# EAGLE schematic NyanTimer-v4 (EAGLE 9.2.2)
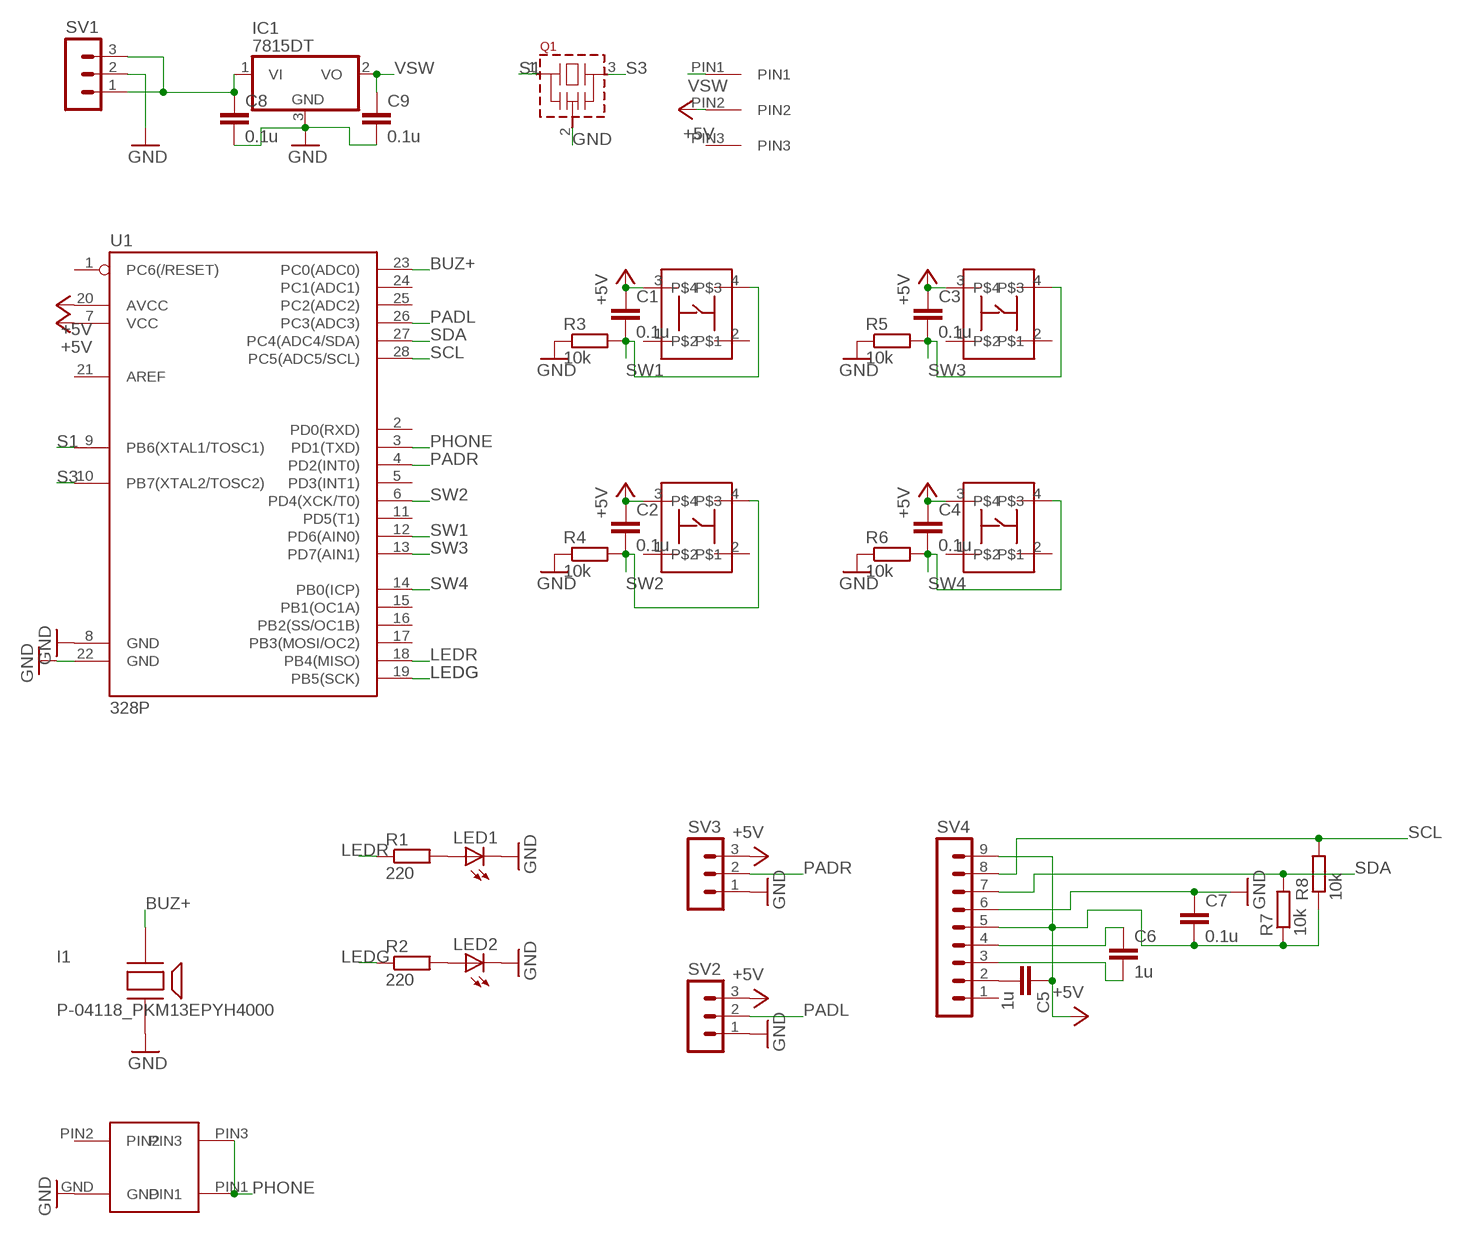
[diagram p0: schematic, sheet 1]

## Parts
C1  0.1u  C-EU025-024X044  [C025-024X044]
C2  0.1u  C-EU025-024X044  [C025-024X044]
C3  0.1u  C-EU025-024X044  [C025-024X044]
C4  0.1u  C-EU025-024X044  [C025-024X044]
C5  1u  C-EU025-024X044  [C025-024X044]
C6  1u  C-EU025-024X044  [C025-024X044]
C7  0.1u  C-EU025-024X044  [C025-024X044]
C8  0.1u  C-EU025-024X044  [C025-024X044]
C9  0.1u  C-EU025-024X044  [C025-024X044]
CONNECTOR1  TACT_SWITCH  [TACT_SWITCH]
CONNECTOR2  TACT_SWITCH  [TACT_SWITCH]
CONNECTOR3  TACT_SWITCH  [TACT_SWITCH]
CONNECTOR4  TACT_SWITCH  [TACT_SWITCH]
I1  P-04118_PKM13EPYH4000  [PKM13EPYH4000]
IC1  7815DT  [TO252]
LED1  LED3MM  [LED3MM]
LED2  LED3MM  [LED3MM]
PHN1  PHONE  [PHONE]
Q1  CSTLA_T  [CSTLA_T]
R1  220  R-EU_0207/10  [0207/10]
R2  220  R-EU_0207/10  [0207/10]
R3  10k  R-EU_0207/10  [0207/10]
R4  10k  R-EU_0207/10  [0207/10]
R5  10k  R-EU_0207/10  [0207/10]
R6  10k  R-EU_0207/10  [0207/10]
R7  10k  R-EU_0207/10  [0207/10]
R8  10k  R-EU_0207/10  [0207/10]
SV1  MA03-1  [MA03-1]
SV2  MA03-1  [MA03-1]
SV3  MA03-1  [MA03-1]
SV4  MA09-1  [MA09-1]
SW1  AKIZUKI_SWITCH  [AKIZUKI_SWITCH]
U1  328P  ATMEGA328P_PDIP  [DIP28]

## Nets
+5V: C1.1 C2.1 C3.1 C4.1 C5.1 C7.2 CONNECTOR1.3 CONNECTOR2.3 CONNECTOR3.3 CONNECTOR4.3 R7.1 R8.1 SV2.3 SV3.3 SV4.5 SV4.9 SW1.PIN2 U1.7(VCC) U1.20(AVCC)
BUZ+: I1.1 U1.23(PC0(ADC0))
GND: C7.1 C8.2 C9.2 I1.2 IC1.3(GND) LED1.K(C) LED2.K(C) PHN1.GND Q1.2(VSS) R3.1 R4.1 R5.1 R6.1 SV1.2 SV2.1 SV3.1 SV4.6 U1.8(GND) U1.22(GND)
LEDG: R2.1 U1.19(PB5(SCK))
LEDR: R1.1 U1.18(PB4(MISO))
N$1: LED1.A R1.2
N$2: LED2.A R2.2
N$3: C5.2 SV4.2
N$4: C6.1 SV4.4
N$5: C6.2 SV4.3
N$6: C8.1 IC1.1(VI) SV1.1 SV1.3
PADL: SV2.2 U1.26(PC3(ADC3))
PADR: SV3.2 U1.4(PD2(INT0))
PHONE: PHN1.PIN1 PHN1.PIN3 U1.3(PD1(TXD))
S1: Q1.1 U1.9(PB6(XTAL1/TOSC1))
S3: Q1.3 U1.10(PB7(XTAL2/TOSC2))
SCL: R8.2 SV4.8 U1.28(PC5(ADC5/SCL))
SDA: R7.2 SV4.7 U1.27(PC4(ADC4/SDA))
SW1: C1.2 CONNECTOR1.4 R3.2 U1.12(PD6(AIN0))
SW2: C2.2 CONNECTOR2.4 R4.2 U1.6(PD4(XCK/T0))
SW3: C3.2 CONNECTOR3.4 R5.2 U1.13(PD7(AIN1))
SW4: C4.2 CONNECTOR4.4 R6.2 U1.14(PB0(ICP))
VSW: C9.1 IC1.2(VO) SW1.PIN1
Unconnected: CONNECTOR1.1 CONNECTOR1.2 CONNECTOR2.1 CONNECTOR2.2 CONNECTOR3.1 CONNECTOR3.2 CONNECTOR4.1 CONNECTOR4.2 PHN1.PIN2 SV4.1 SW1.PIN3 U1.1(PC6(/RESET)) U1.2(PD0(RXD)) U1.5(PD3(INT1)) U1.11(PD5(T1)) U1.15(PB1(OC1A)) U1.16(PB2(SS/OC1B)) U1.17(PB3(MOSI/OC2)) U1.21(AREF) U1.24(PC1(ADC1)) U1.25(PC2(ADC2))

## Library data of the parts
C1-C9 = rcl:C-EU: CAPACITOR, European symbol; SPICEPREFIX: C
CONNECTOR1-CONNECTOR4 = akizuki_tact_switch:TACT_SWITCH: akizuki tact switch
I1 = Akizuki:P-04118_PKM13EPYH4000
IC1 = linear:78*: Positive VOLTAGE REGULATOR Source: http://cache.national.com/ds/LM/LM78L05.pdf http://www.fairchildsemi.com/ds/LM/LM7805.pdf
LED1 LED2 = led:LED: LED OSRAM: - CHIPLED LG R971, LG N971, LY N971, LG Q971, LY Q971, LO R971, LY R971 LH N974, LH R974 LS Q976, LO Q976, LY Q976 LO Q996 - Hyper CHIPLED LW Q18S LB Q993, LB Q99A, LB R99A - SideLED LS A670, LO A670, LY A670, LG A670, LP A670 LB A673, LV A673, LT A673, LW A673 LH A674 LY A675 LS A676, LA A676, LO A676, LY A676, LW A676 LS A679, LY A679, LG A679 - Hyper Micro SIDELED® LS Y876, LA Y876, LO Y876, LY Y876 LT Y87S - SmartLED LW L88C, LW L88S LB L89C, LB L89S, LG L890 LS L89K, LO L89K, LY L89K LS L896, LA L896, LO L896, LY L896 - TOPLED LS T670, LO T670, LY T670, LG T670, LP T670 LSG T670, LSP T670, LSY T670, LOP T670, LYG T670 LG T671, LOG T671, LSG T671 LB T673, LV T673, LT T673, LW T673 LH T674 LS T676, LA T676, LO T676, LY T676, LB T676, LH T676, LSB T676, LW T676 LB T67C, LV T67C, LT T67C, LS T67K, LO T67K, LY T67K, LW E67C LS E67B, LA E67B, LO E67B, LY E67B, LB E67C, LV E67C, LT E67C LW T67C LS T679, LY T679, LG T679 LS T770, LO T770, LY T770, LG T770, LP T770 LB T773, LV T773, LT T773, LW T773 LH T774 LS E675, LA E675, LY E675, LS T675 LS T776, LA T776, LO T776, LY T776, LB T776 LHGB T686 LT T68C, LB T68C - Hyper Mini TOPLED® LB M676 - Mini TOPLED Santana® LG M470 LS M47K, LO M47K, LY M47K Source: http://www.osram.convergy.de LUXEON: - LUMILED® LXK2-PW12-R00, LXK2-PW12-S00, LXK2-PW14-U00, LXK2-PW14-V00 LXK2-PM12-R00, LXK2-PM12-S00, LXK2-PM14-U00 LXK2-PE12-Q00, LXK2-PE12-R00, LXK2-PE12-S00, LXK2-PE14-T00, LXK2-PE14-U00 LXK2-PB12-K00, LXK2-PB12-L00, LXK2-PB12-M00, LXK2-PB14-N00, LXK2-PB14-P00, LXK2-PB14-Q00 LXK2-PR12-L00, LXK2-PR12-M00, LXK2-PR14-Q00, LXK2-PR14-R00 LXK2-PD12-Q00, LXK2-PD12-R00, LXK2-PD12-S00 LXK2-PH12-R00, LXK2-PH12-S00 LXK2-PL12-P00, LXK2-PL12-Q00, LXK2-PL12-R00 Source: www.luxeon.com KINGBRIGHT: KA-3528ASYC Source: www.kingbright.com
PHN1 = akizuki_phone_jack:PHONE: Akizuki phone jack
Q1 = murata-resonators:CSTLA_T: Ceramic resonator 10.01 to 13.00 MHz
R1-R8 = resistor:R-EU_: RESISTOR, European symbol
SV1-SV3 = con-lstb:MA03-1: PIN HEADER; OC_FARNELL: unknown; OC_NEWARK: unknown
SV4 = con-lstb:MA09-1: PIN HEADER; OC_FARNELL: unknown; OC_NEWARK: unknown
SW1 = akizuki_switch:AKIZUKI_SWITCH: akizuki switch 2mm pitch
U1 = SparkFun-IC-Microcontroller:ATMEGA328P_PDIP: Atmel 328P Through hole ATMEGA328P uC used in the Arduino 32kb flash, 1k EEPROM, 2k SRAM Datasheet <http://www.sparkfun.com/datasheets/Components/SMD/ATMega328.pdf> SparkFun Products Storefront component: AVR 28 Pin 20MHz 32K 6A/D - ATMega328P <https://www.sparkfun.com/products/9061> (COM-09061) SparkFun Simon Says - Through-Hole Soldering Kit <https://www.sparkfun.com/products/10547> (KIT-10547) SparkFun Learn to Solder - Simon Says <https://www.sparkfun.com/products/13708> (KIT-13708) SparkFun BigTime Watch Kit <https://www.sparkfun.com/products/11734> (KIT-11734) SparkFun ClockIt <https://www.sparkfun.com/products/10930> (KIT-10930) SparkFun Serial Enabled LCD Kit <https://www.sparkfun.com/products/10097> (LCD-10097) SparkFun Simon Tilts - Through Hole Soldering Kit <https://www.sparkfun.com/products/12634> (KIT-12634) SparkFun Frequency Counter Kit <https://www.sparkfun.com/products/10140> (KIT-10140) FabFM Radio Kit <https://www.sparkfun.com/products/11043> (KIT-11043) SparkFun Binary Blaster Kit <https://www.sparkfun.com/products/12037> (KIT-12037) SparkFun Metro-Gnome <https://www.sparkfun.com/products/9236> (KIT-09236) ATmega328 with Arduino Optiboot (Uno) <https://www.sparkfun.com/products/10524> (DEV-10524); PROD_ID: IC-09136

## Net classes
0 default: width 0.381 mm, clearance 0.381 mm